# EAGLE design Dev_lcd_supply (EAGLE 7.2.0)
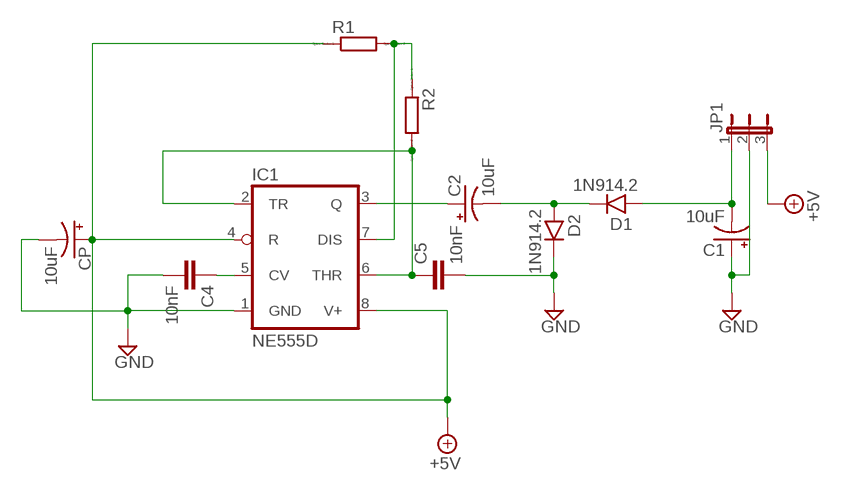
[diagram p0: schematic, sheet 1]

## Parts
C1  10uF  10UF-TANT  [EIA3216]
C2  10uF  10UF-TANT  [EIA3216]
C4  10nF  10NF-CER  [0402-CAP]
C5  10nF  10NF-CER  [0402-CAP]
CP  10uF  10UF-TANT  [EIA3216]
D1  1N914.2  [DO35-2]
D2  1N914.2  [DO35-2]
IC1  NE555D  [SO08]
JP1  JP2E  [JP2]
R1  RR0603  [R0603]
R2  RR0603  [R0603]

## Nets
+5V: CP.A(+) IC1.4(R) IC1.8(V+) JP1.3 R1.1
GND: C1.A(+) C4.2 C5.2 CP.C(-) D2.C IC1.1(GND) JP1.2
N$1: C2.A(+) IC1.3(Q)
N$2: C2.C(-) D1.C D2.A
N$3: C1.C(-) D1.A JP1.1
N$4: C4.1 IC1.5(CV)
N$5: C5.1 IC1.2(TR) IC1.6(THR) R2.2
N$6: IC1.7(DIS) R1.2 R2.1

## Library data of the parts
C1 C2 CP = SparkFun-Retired:10UF-TANT: 10uF Tantalum SMT CAP-00811- 16V 10% (EIA-3216); PROD_ID: CAP-00811
C4 C5 = SparkFun-Retired:10NF-CER: 10nF/.01uF/10000pF ceramic SMT CAP-00867- 50V 10% (0603); PROD_ID: CAP-00867
D1 D2 = gm-diodes:1N914: Fast Switching Diode DO-35 glass case a.k.a. 1N4148
IC1 = linear:*555: TIMER
JP1 = jumper:JP2E: JUMPER
R1 R2 = eagle-ltspice:R: RESISTOR, European symbol; SPICEMODEL: NONE; SPICEPREFIX: R

## Board
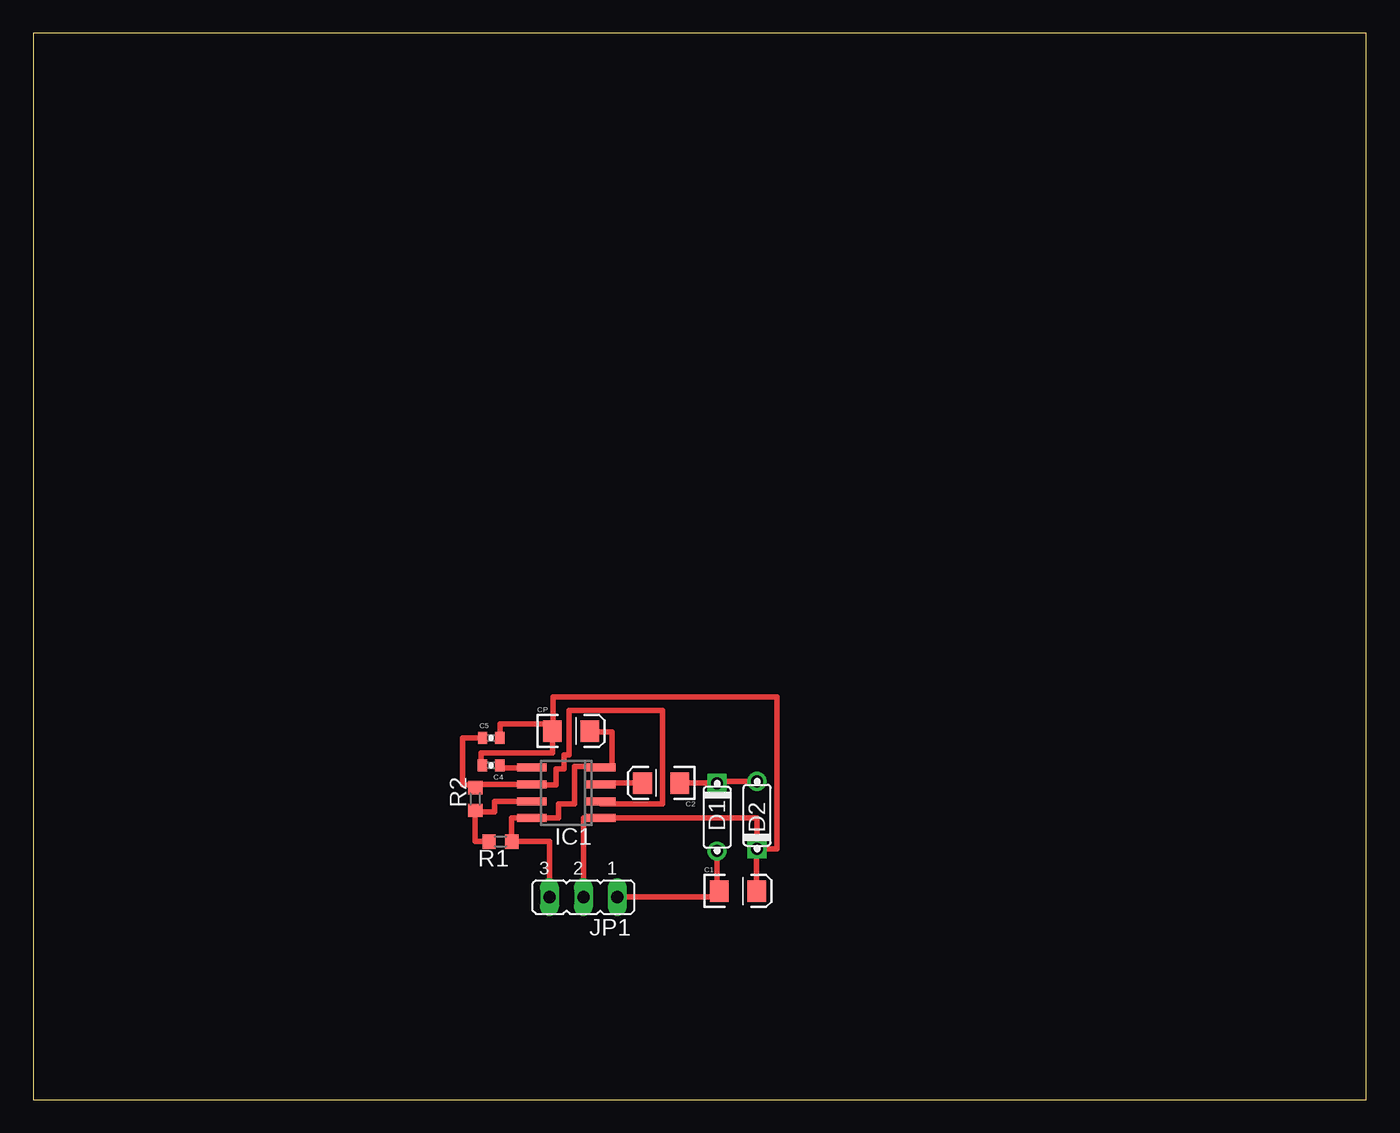
[diagram p1: board, top side]
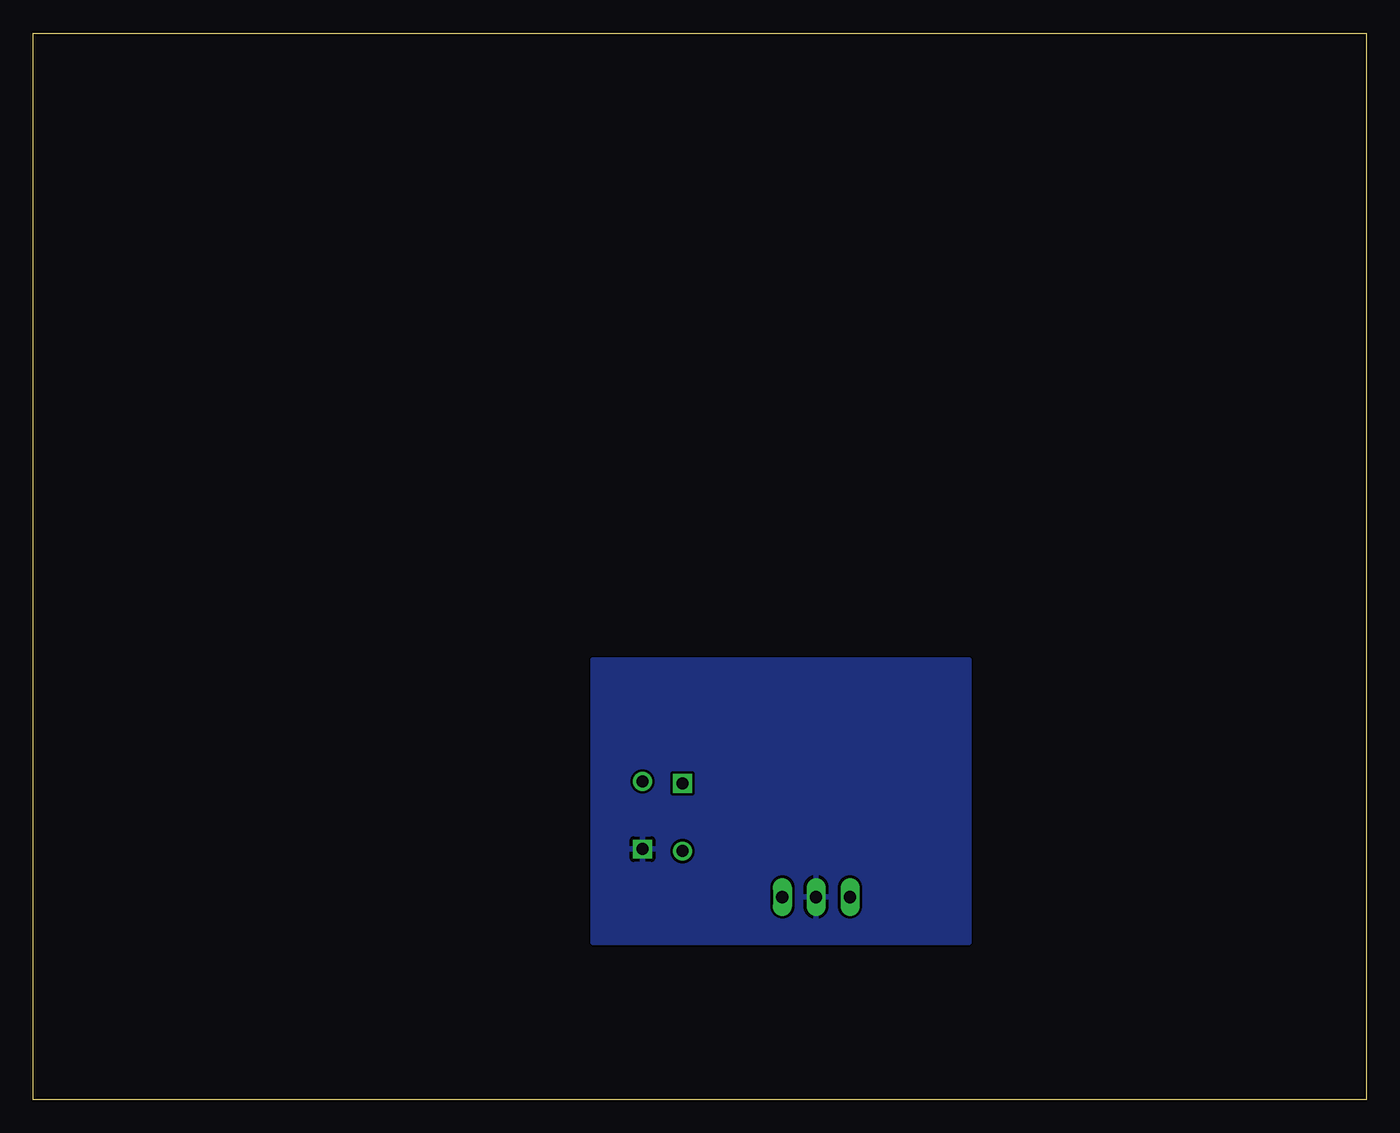
[diagram p2: board, bottom side, seen from below]

Size 100 x 80 mm. Coordinates in mm from the lower left corner, seen from the top.
Outline: 0,0 100,0 100,80 0,80 0,0
Copper layers (1*16): Top 0.035mm / dielectric 1.5mm / Bottom 0.035mm
Design rules "default": minimum track width 10mil, minimum drill 24mil, track to track 8mil, track to pad 8mil, pad to pad 8mil, via to via 8mil, smd to smd 8mil, copper to edge 40mil, drill to drill 8mil, minimum pad ring 10mil, minimum via ring 8mil, stop-mask expansion 4mil, vias tented up to drill 0mil, thermal gap 10mil

### Footprints (pad centres in the part's own frame; a part is rotated, then mirrored left to right if it is on the bottom)
EIA3216 = smd 1.4 x 1.6: A 1.4,0; C -1.4,0
0402-CAP = smd 0.7 x 0.9: 1 -0.65,0; 2 0.65,0
DO35-2 = drill 0.9: A 2.54,0 | drill 0.9 square: C -2.54,0
SO08 = smd 0.6 x 2.2: 1 -1.905,-2.6; 2 -0.635,-2.6; 3 0.635,-2.6; 4 1.905,-2.6; 5 1.905,2.6; 6 0.635,2.6; 7 -0.635,2.6; 8 -1.905,2.6
JP2 = drill 0.914 long: 1 -2.54,0; 2 0,0; 3 2.54,0
R0603 = smd 1 x 1.1: 1 -0.85,0; 2 0.85,0

### Placement (x,y rotation side)
C1  52.87,15.64 0 top
C2  47.11,23.75 180 top
C4  34.34,25.08 180 top
C5  34.36,27.13 0 top
CP  40.34,27.65 0 top
D1  51.3,21.18 270 top
D2  54.3,21.33 90 top
IC1  39.99,23.02 90 top
JP1  41.27,15.19 180 top
R1  35.04,19.36 180 top
R2  33.16,22.55 90 top

### Tracks (layer width: path | path; a pad name or v marks a point on that pad's centre or on a via)
+5V
  Top 0.406: CP.A 41.74,27.6 43.4,27.6 43.4,24.93 IC1.4 42.59,25 40.6,25 40.6,22.2 39.4,22.2 39.4,21.11 IC1.8 35.89,21.11 R1.1 38.73,19.36 JP1.3
GND
  Top 0.406: C4.2 33.6,25.08 33.6,26 38.94,26 CP.C | 38.94,28.2 CP.C | D2.C 54.27,18.79 C1.A | CP.C 39,27.65 39,30.2 55.8,30.2 55.8,18.8 D2.C | D2.C 54.3,21.11 IC1.1 41.27,21.11 JP1.2 | C5.2 35,28.2 38.94,28.2 | 38.94,28.2 38.94,28.33
  pour Bottom: 29.8,32.6 29.8,11.8 58,11.8 58,33 29.8,33 29.8,32.4
N$1
  Top 0.406: C2.A 42.59,23.75 IC1.3
N$2
  Top 0.406: D2.A 51.3,23.87 D1.C 51.3,23.75 C2.C
N$3
  Top 0.406: D1.A 51.3,15.64 C1.C 51.47,15.19 JP1.1
N$4
  Top 0.406: IC1.5 37.39,24.88 34.99,24.88 C4.1
N$5
  Top 0.406: C5.1 32.2,27.13 32.2,23.6 33.16,23.6 R2.2 33.16,23.66 IC1.6 37.39,23.6 39.2,23.6 39.2,24.8 39.8,24.8 39.8,25.86 40.2,25.86 40.2,29.2 47.2,29.2 47.2,22.2 42.59,22.2 IC1.2
N$6
  Top 0.406: IC1.7 34.6,22.39 34.6,21.6 33.16,21.6 R2.1 33.16,19.36 R1.2